# Altium project motor_driver_current_sense.PrjPCB
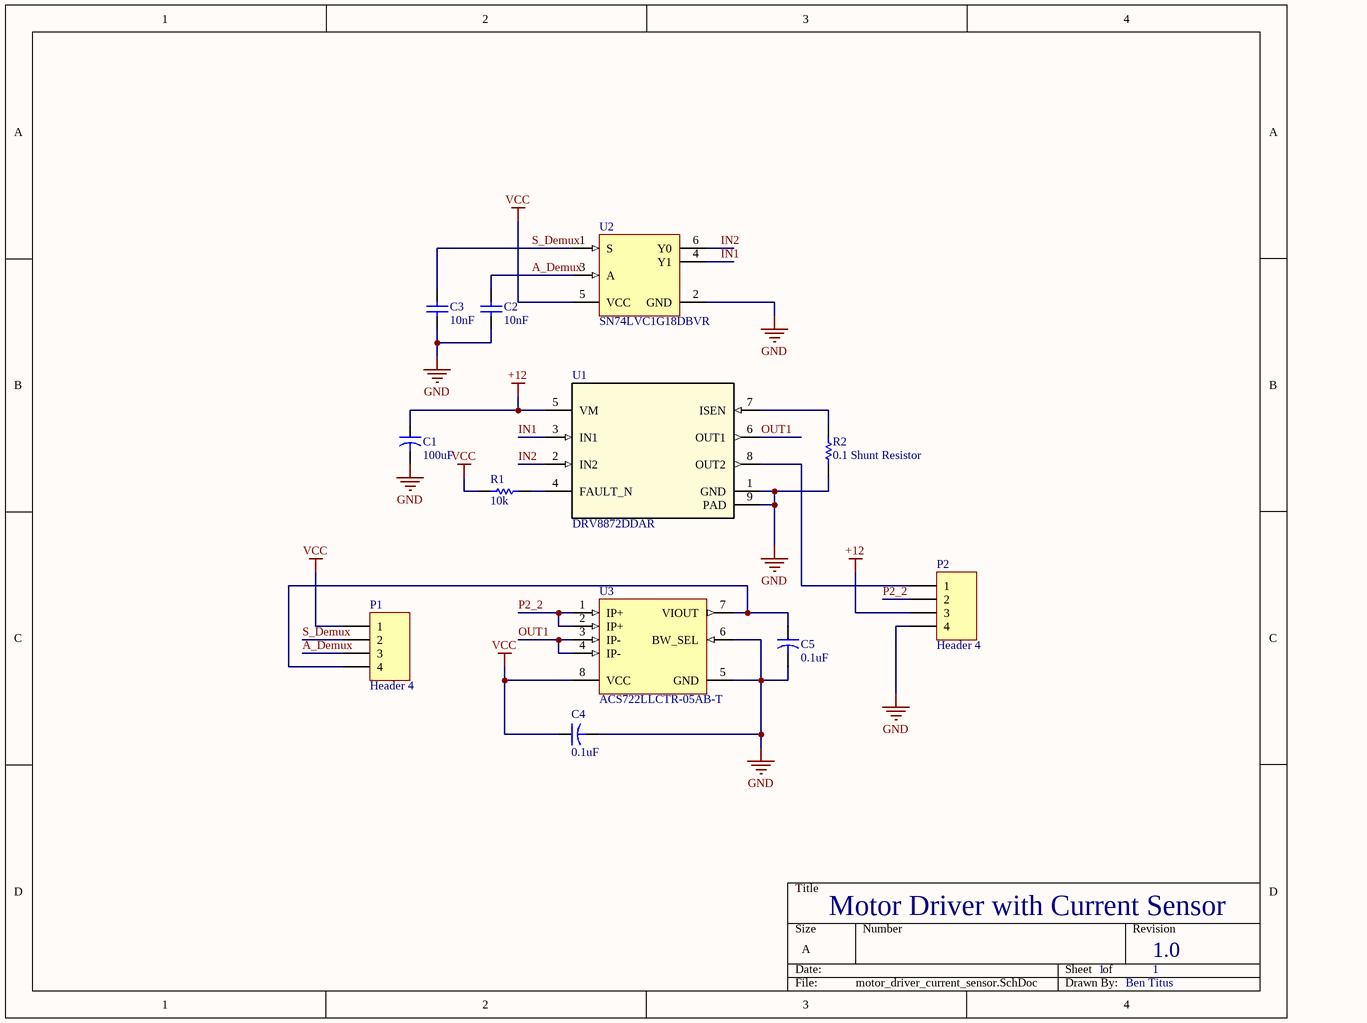
[diagram p0: motor_driver_current_sensor.SchDoc]
1 sheet, 12 parts. Net scope: global (net labels, ports and power ports of the same name join across sheets).
Board file: motor_driver_current_sensor.PcbDoc

## Sheet motor_driver_current_sensor.SchDoc
size A

### Parts
C1  100uF  [CAPR5-4X5]
C2  10nF  [CAPC0805(2012)145_L]
C3  10nF  [CAPC0805(2012)145_L]
C4  0.1uF  [CAPR5-4X5]
C5  0.1uF  [CAPR5-4X5]
P1  Header 4  [HDR1X4]
P2  Header 4  [HDR1X4]
R1  10k  [RESC0805(2012)_L]
R2  0.1 Shunt Resistor  [RESC2512(6432)_L]
U1  DRV8872DDAR  [DDA0008H_N]
U2  SN74LVC1G18DBVR  [DBV0006A_L]
U3  ACS722LLCTR-05AB-T  [ALEG-LC-8_V]

### Nets
+12: C1.1 P2.3 U1.5(VM)
GND: C1.2 C2.1 C3.1 C4.2 C5.2 P2.4 R2.1 U1.1(GND) U1.9(PAD) U2.2(GND) U3.5(GND) U3.6(BW_SEL)
VCC: C4.1 P1.1 R1.1 U2.5(VCC) U3.8(VCC)
A_Demux: C2.2 P1.3 U2.3(A)
IN1: U1.3(IN1) U2.4(Y1)
IN2: U1.2(IN2) U2.6(Y0)
OUT1: U1.6(OUT1) U3.3(IP-) U3.4(IP-)
P2_2: P2.2 U3.1(IP+) U3.2(IP+)
S_Demux: C3.2 P1.2 U2.1(S)
NetC5_1: C5.1 P1.4 U3.7(VIOUT)
NetP2_1: P2.1 U1.8(OUT2)
NetR1_2: R1.2 U1.4(FAULT_N)
NetR2_2: R2.2 U1.7(ISEN)

### Notes on the sheet
- Motor Driver with Current Sensor
- 1
- 1.0
- Ben Titus

### Library data of the parts
C1 = Cap2: 100uF Filter Capacitor; Published: 23-Sep-2002; PackageReference: CAPR5-4X5; Publisher: Altium Limited; PackageDescription: Capacitor; 2 Leads; Value: 100uF
C2 C3 = CMP-1590-00003-1: 0805 (2012 Metric) Chip Capacitor; Case-EIA: 0805; Case-Metric: 2012; PackageReference: CAPC0805(2012)145
C4 C5 = Cap2: Capacitor; Published: 23-Sep-2002; PackageReference: CAPR5-4X5; Publisher: Altium Limited; PackageDescription: Capacitor; 2 Leads; Value: 0.1uF
P1 P2 = Header 4: Header, 4-Pin; LatestRevisionDate: 17-Jul-2002; LatestRevisionNote: Re-released for DXP Platform.; Publisher: Altium Limited
R1 = CMP-1591-00002-1: 0805 (2012 Metric) Chip Resistor; Case-EIA: 0805; Case-Metric: 2012; PackageReference: RESC0805(2012)
R2 = CMP-1591-00007-1: 2512 (6432 Metric) Chip Resistor; Case-EIA: 2512; Case-Metric: 6432; PackageReference: RESC2512(6432)
U1 = DRV8872DDAR: Imported; Manufacturer: Texas Instruments; CompType: IC; PIN_COUNT: 9; PartNumber: DRV8872DDAR; Alternate_PartNumber: DRV8872DDA; PackageReference: DDA0008H; MountType: SMT; RefDes: RefDes; TYPE: TYPE; Value: Value
U2 = CMP-0859-00184-3: One of Two Noninverting Demultiplexer with 3-State Deselected Output, DBV0006A, LARGE T&R; Manufacturer: Texas Instruments; Technology Family: LVC; Specialty Logic Family: Decoder/Encoder/Multiplexer; 3-State Output: No; F @ Nom Voltage(Max)(Mhz): 150; VCC(Max)(V): 5.5; Rating: Catalog; Logic: True; Output Type: CMOS; Voltage(Nom)(V): 1.8,2.5,3.3,5; Output Drive (IOL/IOH)(Max)(mA): 32/-32; tpd @ Nom Voltage(Max)(ns): 9.3,5,4.2,3.2; Input Type: CMOS/TTL; Bits(#): 1; ICC @ Nom Voltage(Max)(mA): 0.01; VCC(Min)(V): 1.65; Generic Part Number: SN74LVC1G18; Operating Temperature Range(C): -40 to 85; Sub-Family: Decoder/Encoder/Multiplexer; PackageReference: DBV0006A; DatasheetVersion: SCES406K; Schmitt Trigger: No
U3 = CMP-1557-00006-1: High Accuracy, Galvanically Isolated Current Sensor IC, 3 to 3.6 V, -5 to 5 A IP, -40 to 150 degC, 8-Pin SOIC (LC), RoHS, Tape and Reel; VCC Min: 3 V; IP Max: 5 A; IP Min: -5 A; VCC Max: 3.6 V; ComponentLink3URL: http://www.allegromicro.com/~/media/Files/Datasheets/ACS711-Datasheet.ashx?la=en; RoHS: TRUE; PartNumber: ACS722LLCTR-05AB-T; ComponentLink1Description: Manufacturer URL; ComponentLink1URL: http://www.allegromicro.com/; ComponentLink3Description: Package Specification; Temperature Min: -40 degC; Packing: Tape and Reel; PackageDescription: 8-Pin Small Outline Integrated Package, Body 4.9 x 3.9 mm, Pitch 1.27 mm; ComponentLink2URL: http://www.allegromicro.com/~/media/Files/Datasheets/ACS722-Datasheet.ashx?la=en; Mounting Technology: Surface Mount; Temperature Max: 150 degC; ComponentLink2Description: Datasheet